# Altium schematic sheet 3点震荡v1.SchDoc
size A0
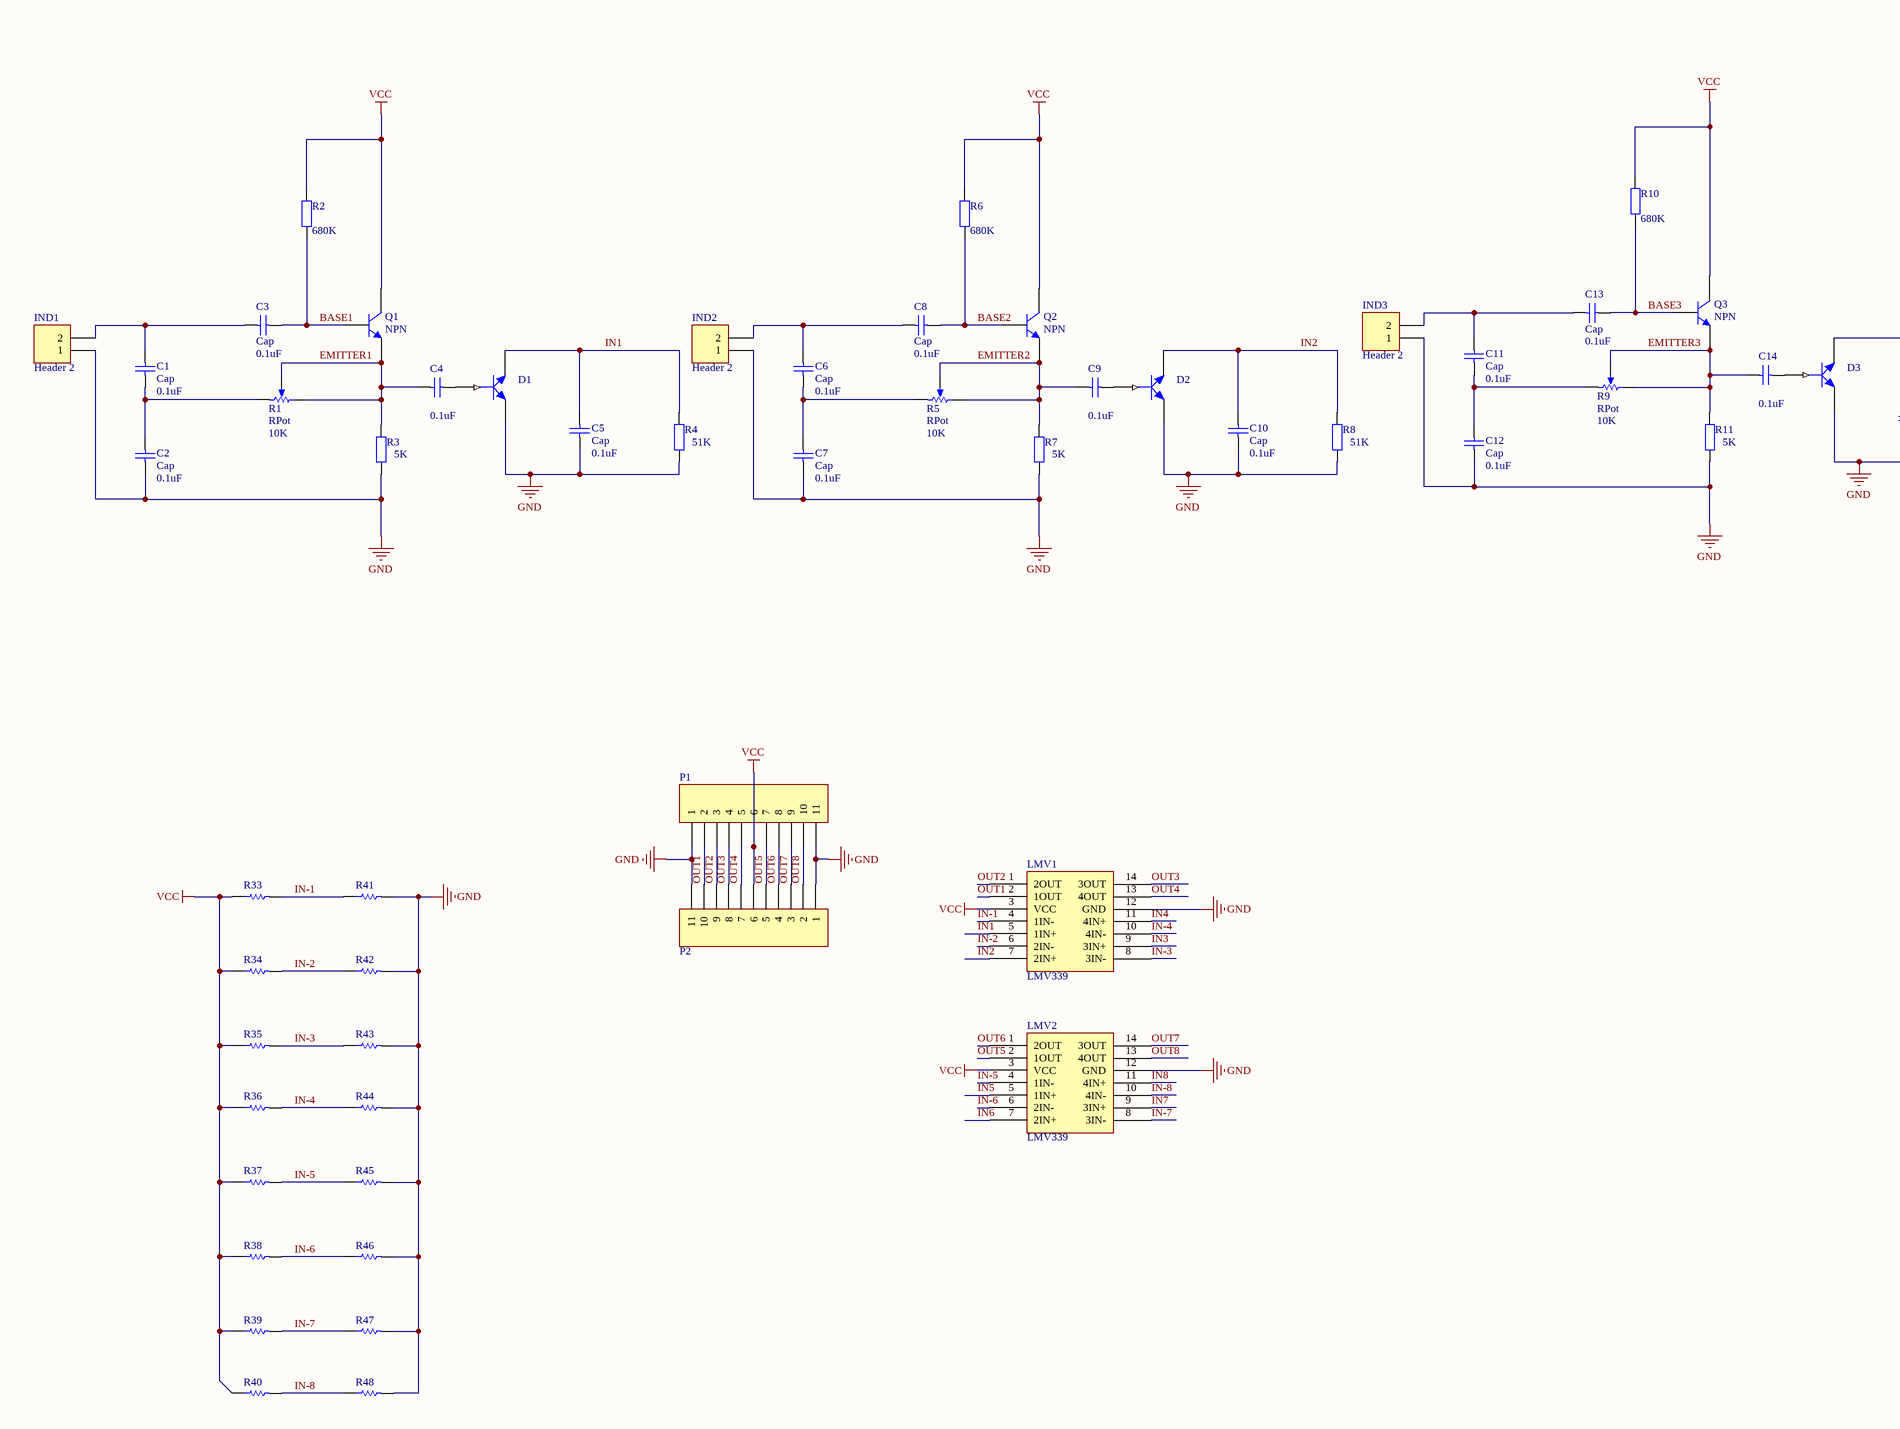
[diagram p0: 3点震荡v1.SchDoc, left]
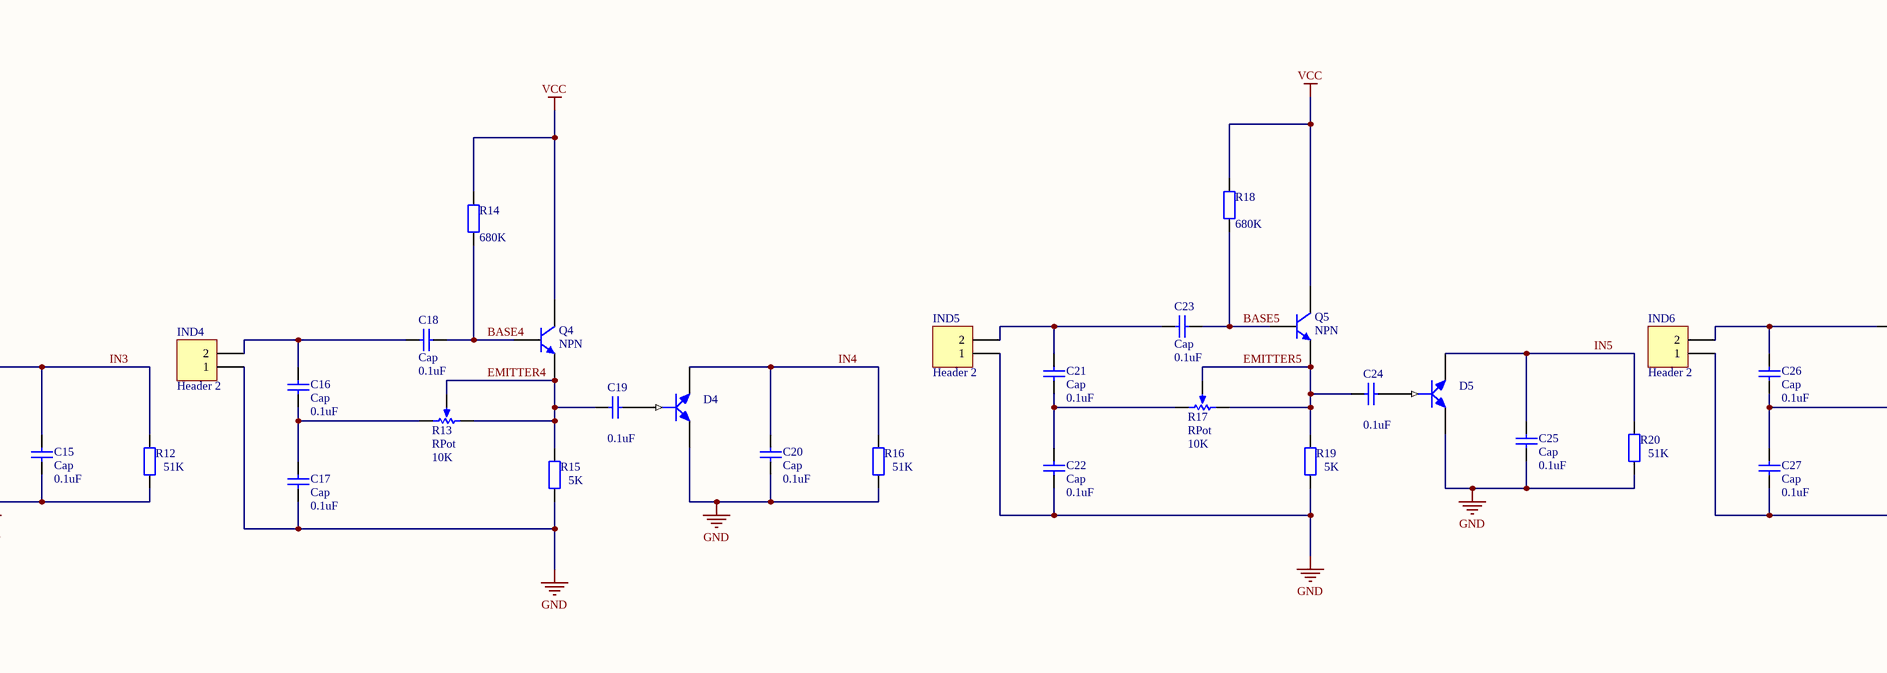
[diagram p1: 3点震荡v1.SchDoc, middle]
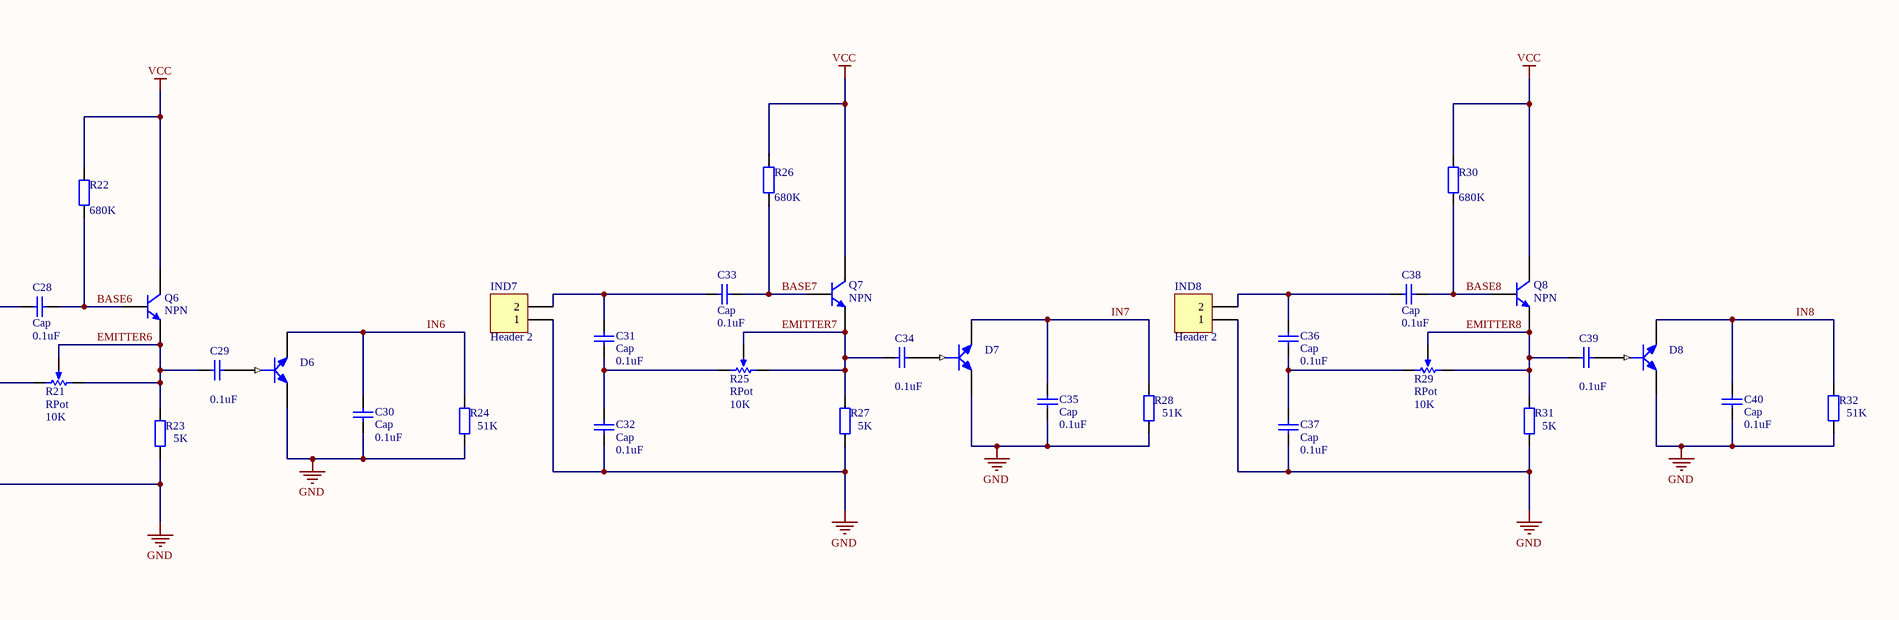
[diagram p2: 3点震荡v1.SchDoc, right]

## Parts
C1  Cap  value 0.1uF  [C2012]
C2  Cap  value 0.1uF  [C2012]
C3  Cap  value 0.1uF  [C2012]
C4  value 0.1uF  [C2012]  (hidden comment: Cap)
C5  Cap  value 0.1uF  [c2012]
C6  Cap  value 0.1uF  [C2012]
C7  Cap  value 0.1uF  [C2012]
C8  Cap  value 0.1uF  [C2012]
C9  value 0.1uF  [C2012]  (hidden comment: Cap)
C10  Cap  value 0.1uF  [c2012]
C11  Cap  value 0.1uF  [C2012]
C12  Cap  value 0.1uF  [C2012]
C13  Cap  value 0.1uF  [C2012]
C14  value 0.1uF  [C2012]  (hidden comment: Cap)
C15  Cap  value 0.1uF  [c2012]
C16  Cap  value 0.1uF  [C2012]
C17  Cap  value 0.1uF  [C2012]
C18  Cap  value 0.1uF  [C2012]
C19  value 0.1uF  [C2012]  (hidden comment: Cap)
C20  Cap  value 0.1uF  [c2012]
C21  Cap  value 0.1uF  [C2012]
C22  Cap  value 0.1uF  [C2012]
C23  Cap  value 0.1uF  [C2012]
C24  value 0.1uF  [C2012]  (hidden comment: Cap)
C25  Cap  value 0.1uF  [c2012]
C26  Cap  value 0.1uF  [C2012]
C27  Cap  value 0.1uF  [C2012]
C28  Cap  value 0.1uF  [C2012]
C29  value 0.1uF  [C2012]  (hidden comment: Cap)
C30  Cap  value 0.1uF  [c2012]
C31  Cap  value 0.1uF  [C2012]
C32  Cap  value 0.1uF  [C2012]
C33  Cap  value 0.1uF  [C2012]
C34  value 0.1uF  [C2012]  (hidden comment: Cap)
C35  Cap  value 0.1uF  [c2012]
C36  Cap  value 0.1uF  [C2012]
C37  Cap  value 0.1uF  [C2012]
C38  Cap  value 0.1uF  [C2012]
C39  value 0.1uF  [C2012]  (hidden comment: Cap)
C40  Cap  value 0.1uF  [c2012]
D1  Diac-NPN  [SOT23_N]  (value not drawn)
D2  Diac-NPN  [SOT23_N]  (value not drawn)
D3  Diac-NPN  [SOT23_N]  (value not drawn)
D4  Diac-NPN  [SOT23_N]  (value not drawn)
D5  Diac-NPN  [SOT23_N]  (value not drawn)
D6  Diac-NPN  [SOT23_N]  (value not drawn)
D7  Diac-NPN  [SOT23_N]  (value not drawn)
D8  Diac-NPN  [SOT23_N]  (value not drawn)
IND1  Header 2  [HDR1X2]
IND2  Header 2  [HDR1X2]
IND3  Header 2  [HDR1X2]
IND4  Header 2  [HDR1X2]
IND5  Header 2  [HDR1X2]
IND6  Header 2  [HDR1X2]
IND7  Header 2  [HDR1X2]
IND8  Header 2  [HDR1X2]
LMV1  LMV339  [LMV339 TSSOP14]
LMV2  LMV339  [LMV339 TSSOP14]
P1  Header 11  [HDR1X11]  (value not drawn)
P2  Header 11  [FFC/SM1.0-2H11]  (value not drawn)
Q1  NPN  [SOT23_N]
Q2  NPN  [SOT23_N]
Q3  NPN  [SOT23_N]
Q4  NPN  [SOT23_N]
Q5  NPN  [SOT23_N]
Q6  NPN  [SOT23_N]
Q7  NPN  [SOT23_N]
Q8  NPN  [SOT23_N]
R1  RPot  value 10K  [pot（长方形）]
R2  value 680K  [r2012]  (hidden comment: Res2)
R3  value 5K  [R2012]  (hidden comment: Res2)
R4  value 51K  [R2012]  (hidden comment: Res2)
R5  RPot  value 10K  [pot（长方形）]
R6  value 680K  [r2012]  (hidden comment: Res2)
R7  value 5K  [R2012]  (hidden comment: Res2)
R8  value 51K  [R2012]  (hidden comment: Res2)
R9  RPot  value 10K  [pot（长方形）]
R10  value 680K  [r2012]  (hidden comment: Res2)
R11  value 5K  [R2012]  (hidden comment: Res2)
R12  value 51K  [R2012]  (hidden comment: Res2)
R13  RPot  value 10K  [pot（长方形）]
R14  value 680K  [r2012]  (hidden comment: Res2)
R15  value 5K  [R2012]  (hidden comment: Res2)
R16  value 51K  [R2012]  (hidden comment: Res2)
R17  RPot  value 10K  [pot（长方形）]
R18  value 680K  [r2012]  (hidden comment: Res2)
R19  value 5K  [R2012]  (hidden comment: Res2)
R20  value 51K  [R2012]  (hidden comment: Res2)
R21  RPot  value 10K  [pot（长方形）]
R22  value 680K  [r2012]  (hidden comment: Res2)
R23  value 5K  [R2012]  (hidden comment: Res2)
R24  value 51K  [R2012]  (hidden comment: Res2)
R25  RPot  value 10K  [pot（长方形）]
R26  value 680K  [r2012]  (hidden comment: Res2)
R27  value 5K  [R2012]  (hidden comment: Res2)
R28  value 51K  [R2012]  (hidden comment: Res2)
R29  RPot  value 10K  [pot（长方形）]
R30  value 680K  [r2012]  (hidden comment: Res2)
R31  value 5K  [R2012]  (hidden comment: Res2)
R32  value 51K  [R2012]  (hidden comment: Res2)
R33  Res  [R2012]  (value not drawn)
R34  Res  [R2012]  (value not drawn)
R35  Res  [R2012]  (value not drawn)
R36  Res  [R2012]  (value not drawn)
R37  Res  [R2012]  (value not drawn)
R38  Res  [R2012]  (value not drawn)
R39  Res  [R2012]  (value not drawn)
R40  Res  [R2012]  (value not drawn)
R41  Res  [R2012]  (value not drawn)
R42  Res  [R2012]  (value not drawn)
R43  Res  [R2012]  (value not drawn)
R44  Res  [R2012]  (value not drawn)
R45  Res  [R2012]  (value not drawn)
R46  Res  [R2012]  (value not drawn)
R47  Res  [R2012]  (value not drawn)
R48  Res  [R2012]  (value not drawn)

## Nets
GND: C2.2 C5.2 C7.2 C10.2 C12.2 C15.2 C17.2 C20.2 C22.2 C25.2 C27.2 C30.2 C32.2 C35.2 C37.2 C40.2 D1.3(E) D2.3(E) D3.3(E) D4.3(E) D5.3(E) D6.3(E) D7.3(E) D8.3(E) IND1.1 IND2.1 IND3.1 IND4.1 IND5.1 IND6.1 IND7.1 IND8.1 LMV1.12(GND) LMV2.12(GND) P1.1 P1.11 P2.1 P2.11 R3.1 R4.1 R7.1 R8.1 R11.1 R12.1 R15.1 R16.1 R19.1 R20.1 R23.1 R24.1 R27.1 R28.1 R31.1 R32.1 R41.2 R42.2 R43.2 R44.2 R45.2 R46.2 R47.2 R48.2
VCC: LMV1.3(VCC) LMV2.3(VCC) P1.6 P2.6 Q1.1(C) Q2.1(C) Q3.1(C) Q4.1(C) Q5.1(C) Q6.1(C) Q7.1(C) Q8.1(C) R2.2 R6.2 R10.2 R14.2 R18.2 R22.2 R26.2 R30.2 R33.1 R34.1 R35.1 R36.1 R37.1 R38.1 R39.1 R40.1
BASE1: C3.1 Q1.2(B) R2.1
BASE2: C8.1 Q2.2(B) R6.1
BASE3: C13.1 Q3.2(B) R10.1
BASE4: C18.1 Q4.2(B) R14.1
BASE5: C23.1 Q5.2(B) R18.1
BASE6: C28.1 Q6.2(B) R22.1
BASE7: C33.1 Q7.2(B) R26.1
BASE8: C38.1 Q8.2(B) R30.1
EMITTER1: C4.1 Q1.3(E) R1.1(TOP) R1.3(TAP) R3.2
EMITTER2: C9.1 Q2.3(E) R5.1(TOP) R5.3(TAP) R7.2
EMITTER3: C14.1 Q3.3(E) R9.1(TOP) R9.3(TAP) R11.2
EMITTER4: C19.1 Q4.3(E) R13.1(TOP) R13.3(TAP) R15.2
EMITTER5: C24.1 Q5.3(E) R17.1(TOP) R17.3(TAP) R19.2
EMITTER6: C29.1 Q6.3(E) R21.1(TOP) R21.3(TAP) R23.2
EMITTER7: C34.1 Q7.3(E) R25.1(TOP) R25.3(TAP) R27.2
EMITTER8: C39.1 Q8.3(E) R29.1(TOP) R29.3(TAP) R31.2
IN1: C5.1 D1.2(C) LMV1.5(1IN+) R4.2
IN2: C10.1 D2.2(C) LMV1.7(2IN+) R8.2
IN3: C15.1 D3.2(C) LMV1.9(3IN+) R12.2
IN4: C20.1 D4.2(C) LMV1.11(4IN+) R16.2
IN5: C25.1 D5.2(C) LMV2.5(1IN+) R20.2
IN6: C30.1 D6.2(C) LMV2.7(2IN+) R24.2
IN7: C35.1 D7.2(C) LMV2.9(3IN+) R28.2
IN8: C40.1 D8.2(C) LMV2.11(4IN+) R32.2
IN-1: LMV1.4(1IN-) R33.2 R41.1
IN-2: LMV1.6(2IN-) R34.2 R42.1
IN-3: LMV1.8(3IN-) R35.2 R43.1
IN-4: LMV1.10(4IN-) R36.2 R44.1
IN-5: LMV2.4(1IN-) R37.2 R45.1
IN-6: LMV2.6(2IN-) R38.2 R46.1
IN-7: LMV2.8(3IN-) R39.2 R47.1
IN-8: LMV2.10(4IN-) R40.2 R48.1
OUT1: LMV1.2(1OUT) P1.2 P2.10
OUT2: LMV1.1(2OUT) P1.3 P2.9
OUT3: LMV1.14(3OUT) P1.4 P2.8
OUT4: LMV1.13(4OUT) P1.5 P2.7
OUT5: LMV2.2(1OUT) P1.7 P2.5
OUT6: LMV2.1(2OUT) P1.8 P2.4
OUT7: LMV2.14(3OUT) P1.9 P2.3
OUT8: LMV2.13(4OUT) P1.10 P2.2
NetC1_1: C1.1 C3.2 IND1.2
NetC1_2: C1.2 C2.1 R1.2(BOT)
NetC4_2: C4.2 D1.1(B)
NetC6_1: C6.1 C8.2 IND2.2
NetC6_2: C6.2 C7.1 R5.2(BOT)
NetC9_2: C9.2 D2.1(B)
NetC11_1: C11.1 C13.2 IND3.2
NetC11_2: C11.2 C12.1 R9.2(BOT)
NetC14_2: C14.2 D3.1(B)
NetC16_1: C16.1 C18.2 IND4.2
NetC16_2: C16.2 C17.1 R13.2(BOT)
NetC19_2: C19.2 D4.1(B)
NetC21_1: C21.1 C23.2 IND5.2
NetC21_2: C21.2 C22.1 R17.2(BOT)
NetC24_2: C24.2 D5.1(B)
NetC26_1: C26.1 C28.2 IND6.2
NetC26_2: C26.2 C27.1 R21.2(BOT)
NetC29_2: C29.2 D6.1(B)
NetC31_1: C31.1 C33.2 IND7.2
NetC31_2: C31.2 C32.1 R25.2(BOT)
NetC34_2: C34.2 D7.1(B)
NetC36_1: C36.1 C38.2 IND8.2
NetC36_2: C36.2 C37.1 R29.2(BOT)
NetC39_2: C39.2 D8.1(B)

## Library data of the parts
C1-C40 = Cap: Capacitor; Published: 8-Jun-2000; LatestRevisionDate: 17-Jul-2002; LatestRevisionNote: Re-released for DXP Platform.; PackageReference: RAD-0.3; Publisher: Altium Limited; PackageDescription: Radial Cap, Thru-Hole; 2 Leads; 0.3 in Pin Spacing
D1-D8 = Diac-NPN: DIAC; Published: 24-Mar-1999; LatestRevisionDate: 17-Jul-2002; LatestRevisionNote: Re-released for DXP Platform.; PackageReference: TO-262-AA; Publisher: Altium Limited; Code_JEDEC: TO-262-AA
IND1-IND8 = Header 2: Header, 2-Pin; LatestRevisionDate: 17-Jul-2002; LatestRevisionNote: Re-released for DXP Platform.; Publisher: Altium Limited
P1 P2 = Header 11: Header, 11-Pin; LatestRevisionDate: 17-Jul-2002; LatestRevisionNote: Re-released for DXP Platform.; Publisher: Altium Limited
Q1-Q8 = NPN: NPN Bipolar Transistor; pin to pad: 2>3 3>2; Published: 8-Jun-2000; LatestRevisionDate: 17-Jul-2002; LatestRevisionNote: Re-released for DXP Platform.; PackageReference: TO-226-AA; Publisher: Altium Limited; PackageDescription: TO, Flat Index; 3 In-Line, Axial Leads; Body Dia. 4.8mm; Leads 0.55 x 0.51 mm (max); Code_JEDEC: TO-226-AA
R1 R5 R9 R13 R17 R21 R25 R29 = RPot: Potentiometer; pin to pad: 1>2 2>1; Sim Note: Enter the Resistance value and the set point into parameter fields.; Set Position: 0.5; Published: 8-Jun-2000; LatestRevisionDate: 17-Jul-2002; LatestRevisionNote: Re-released for DXP Platform.; PackageReference: VR5; Publisher: Altium Limited; PackageDescription: Variable Resistor, Thru-Hole; 3 Leads
R2-R4 R6-R8 R10-R12 R14-R16 R18-R20 R22-R24 R26-R28 R30-R32 = Res2: Resistor; Published: 8-Jun-2000; LatestRevisionDate: 17-Jul-2002; LatestRevisionNote: Re-released for DXP Platform.; PackageReference: AXIAL-0.4; Publisher: Altium Limited; PackageDescription: Axial Device, Thru-Hole; 2 Leads; 0.4 in Pin Spacing
R33-R48 = Res: 贴片电阻; Value: 1K; Published: 8-Jun-2000; LatestRevisionDate: 17-Jul-2002; LatestRevisionNote: Re-released for DXP Platform.; PackageReference: AXIAL-0.3; Publisher: Altium Limited